# Altium schematic sheet 3_Screen & Others.schdoc
size 497 x 243 mm; Name: A_A4; Symbol: A_A4; Device: A_A4; @Project Name: Arduboy GamePlayer - Screen &amp; Others; REV: 5.0; Date: 2022-04-23; Sheet: 3 /3; Draw By: LiLinBai; Company: FastLab Team; Convert to PCB: yes; Add into BOM: yes
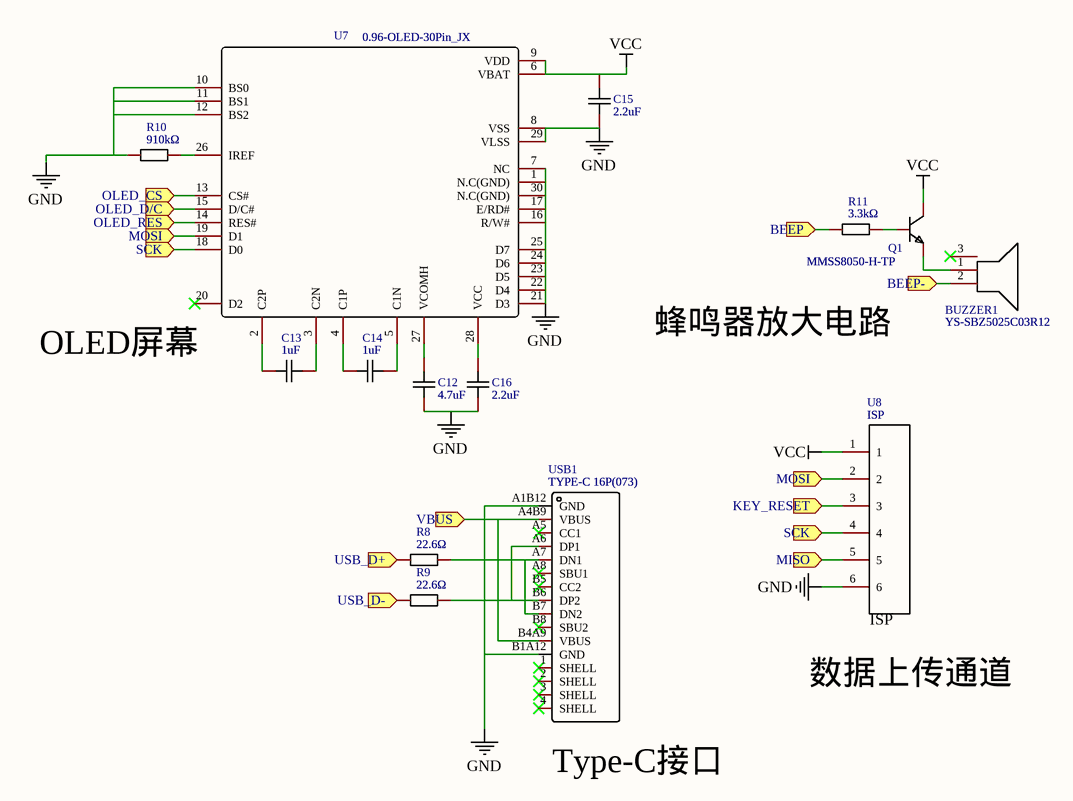
[diagram p0: 3_Screen & Others.schdoc]

## Parts
BUZZER1  YS-SBZ5025C03R12  [BUZ-SMD_L5.0-W5.5-P4.60]
C12  4.7uF  [C0603]
C13  1uF  [C0603]
C14  1uF  [C0603]
C15  2.2uF  [C0603]
C16  2.2uF  [C0603]
Q1  MMSS8050-H-TP  [SOT-23-3_L2.9-W1.6-P1.90-LS2.8-BR]
R8  22.6Ω  [R0603]
R9  22.6Ω  [R0603]
R10  910kΩ  [R0603]
R11  3.3kΩ  [R0603]
U7  0.96-OLED-30Pin_JX  [SSD1306-30PIN_JX]
U8  ISP  [ISP 06]
USB1  TYPE-C 16P(073)  [USB-C-SMD_TYPE-C16PIN_C668624]

## Ports
BEEP (in), BEEP- (in), KEY_RESET (in), MISO (in), MOSI (in), OLED_CS (in), OLED_D/C (in), OLED_RES (in), SCK (in), USB_D+ (in), USB_D- (in), VBUS (in)

## Nets
GND: C12.1 C15.1 C16.1 R10.1 U7.1(N.C(GND)) U7.7(NC) U7.8(VSS) U7.10(BS0) U7.11(BS1) U7.12(BS2) U7.16(R/W#) U7.17(E/RD#) U7.21(D3) U7.22(D4) U7.23(D5) U7.24(D6) U7.25(D7) U7.29(VLSS) U7.30(N.C(GND)) U8.6 USB1.A1B12(GND) USB1.B1A12(GND)
VCC: C15.2 Q1.3(C) U7.6(VBAT) U7.9(VDD) U8.1
BEEP: R11.1 ; port BEEP
BEEP-: BUZZER1.2 ; port BEEP-
KEY_RESET: U8.3 ; port KEY_RESET
MISO: U8.5 ; port MISO
MOSI: U7.19(D1) U8.2 ; port MOSI
OLED_CS: U7.13(CS#) ; port OLED_CS
OLED_D/C: U7.15(D/C#) ; port OLED_D/C
OLED_RES: U7.14(RES#) ; port OLED_RES
SCK: U7.18(D0) U8.4 ; port SCK
USB_D+: R8.1 ; port USB_D+
USB_D-: R9.1 ; port USB_D-
VBUS: USB1.A4B9(VBUS) USB1.B4A9(VBUS) ; port VBUS
NetBUZZER1_1: BUZZER1.1 Q1.2(E)
NetC12_2: C12.2 U7.27(VCOMH)
NetC13_1: C13.1 U7.2(C2P)
NetC13_2: C13.2 U7.3(C2N)
NetC14_1: C14.1 U7.4(C1P)
NetC14_2: C14.2 U7.5(C1N)
NetC16_2: C16.2 U7.28(VCC)
NetQ1_1: Q1.1(B) R11.2
NetR8_2: R8.2 USB1.A7(DN1) USB1.B7(DN2)
NetR9_2: R9.2 USB1.A6(DP1) USB1.B6(DP2)
NetR10_2: R10.2 U7.26(IREF)

Not connected (* = marked no-connect by the designer): BUZZER1 3*; U7 20(D2)*; USB1 1(SHELL)* 2(SHELL)* 3(SHELL)* 4(SHELL)* A5(CC1)* A8(SBU1)* B5(CC2)* B8(SBU2)*

## Notes on the sheet
- OLED屏幕
- 蜂鸣器放大电路
- 数据上传通道
- (near USB1) Type-C接口
- 1
- 2
- 3
- 4
- 5
- A
- B
- C
- D
- TITLE:
- Arduboy GamePlayer - Screen &amp; Others
- REV:
- 5.0
- Date:
- Company:
- 2022-04-23
- FastLab Team
- Drawn By:
- LiLinBai
- Sheet:
- 3 /3

## Library data of the parts
BUZZER1 = YS-SBZ5025C03R12: Manufacturer: Fengming; Frequency: 4000Hz; Convert to PCB: yes; Name: YS-SBZ5025C03R12; Symbol: YS-SBZ5025C03R12; Device: YS-SBZ5025C03R12; Supplier: LCSC; Supplier Part: C409844; Manufacturer Part: YS-SBZ5025C03R12; JLCPCB Part Class: Extended Part; Add into BOM: yes; Origin Footprint: BUZ-SMD_L5.0-W5.5-P4.60
C12 = GRM188R61C475KAAJD: Manufacturer: MuRata; Convert to PCB: yes; Name: 4.7uF; Symbol: 4.7uF; Device: GRM188R61C475KAAJD; Supplier: LCSC; Manufacturer Part: GRM188R61C475KAAJD; Supplier Part: C86016; JLCPCB Part Class: Extended Part; Add into BOM: yes; Origin Footprint: C0603
C13 C14 = GRM188R61C105KA93D: Manufacturer: MuRata; Convert to PCB: yes; Name: 1uF; Symbol: 1uF; Device: GRM188R61C105KA93D; Supplier: LCSC; Manufacturer Part: GRM188R61C105KA93D; Supplier Part: C77404; JLCPCB Part Class: Extended Part; Add into BOM: yes; Origin Footprint: C0603
C15 C16 = GRM188R60J225KE19D: Manufacturer: MuRata; Convert to PCB: yes; Name: 2.2uF; Symbol: 2.2uF; Device: GRM188R60J225KE19D; Supplier: LCSC; Manufacturer Part: GRM188R60J225KE19D; Supplier Part: C86011; JLCPCB Part Class: Extended Part; Add into BOM: yes; Origin Footprint: C0603
Q1 = MMSS8050-H-TP: Manufacturer: MCC; Convert to PCB: yes; Name: MMSS8050-H-TP; Symbol: MMSS8050-H-TP; Device: MMSS8050-H-TP; Supplier: LCSC; Manufacturer Part: MMSS8050-H-TP; Supplier Part: C90158; JLCPCB Part Class: Extended Part; Add into BOM: yes; Origin Footprint: SOT-23-3_L2.9-W1.6-P1.90-LS2.8-BR
R8 R9 = CR0603FA22R6G: Manufacturer: LIZ Elec; Resistance: 22.6; Convert to PCB: yes; Name: 22.6Ω; Symbol: 22.6Ω; Device: CR0603FA22R6G; Supplier: LCSC; Supplier Part: C100878; Manufacturer Part: CR0603FA22R6G; JLCPCB Part Class: Extended Part; Add into BOM: yes; Origin Footprint: R0603
R10 = RMC0603910K1%N: Manufacturer: Tyohm; Resistance: 910K; Convert to PCB: yes; Name: 910kΩ; Symbol: 910kΩ; Device: RMC0603910K1%N; Supplier: LCSC; Supplier Part: C325721; Manufacturer Part: RMC0603910K1%N; JLCPCB Part Class: Extended Part; Add into BOM: yes; Origin Footprint: R0603
R11 = RMC06033.3K5%N: Manufacturer: Tyohm; Resistance: 3.3K; Convert to PCB: yes; Name: 3.3kΩ; Symbol: 3.3kΩ; Device: RMC06033.3K5%N; Supplier: LCSC; Supplier Part: C269691; Manufacturer Part: RMC06033.3K5%N; JLCPCB Part Class: Extended Part; Add into BOM: yes; Origin Footprint: R0603
U7 = 0.96-OLED-30Pin_JX: Convert to PCB: yes; Name: 0.96-OLED-30Pin_JX; Symbol: 0.96-OLED-30Pin_JX; Device: 0.96-OLED-30Pin_JX; Supplier: LCSC; Add into BOM: yes; Origin Footprint: SSD1306-30PIN_JX
U8 = ISP: Convert to PCB: yes; Name: ISP; Symbol: ISP; Device: ISP; Add into BOM: yes; Origin Footprint: ISP 06
USB1 = TYPE-C 16P(073): Manufacturer: SHOU HAN; Convert to PCB: yes; Name: TYPE-C 16P(073); Symbol: TYPE-C 16P(073); Device: TYPE-C 16P(073); Supplier: LCSC; Supplier Part: C668624; Manufacturer Part: TYPE-C 16P(073); JLCPCB Part Class: Extended Part; Add into BOM: yes; Origin Footprint: USB-C-SMD_TYPE-C16PIN_C668624